# Altium schematic sheet LED.SchDoc
size A
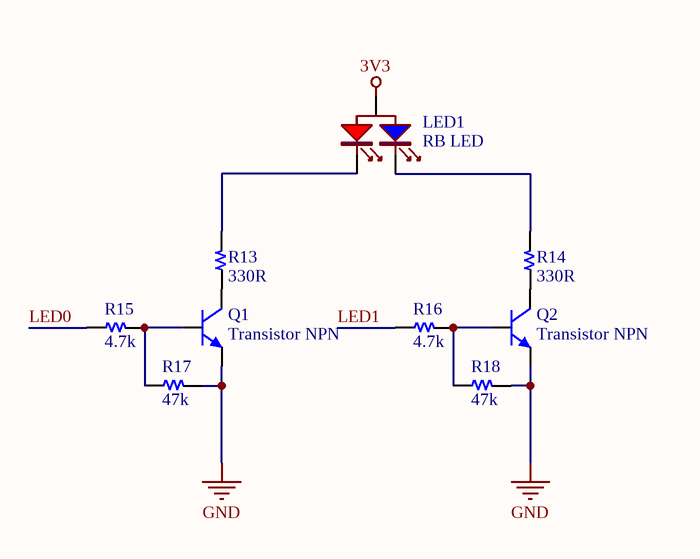
[diagram p0: LED.SchDoc]

## Parts
LED1  RB LED  [LED-BICOLOR-3MM]
Q1  Transistor NPN  [SOT-23]
Q2  Transistor NPN  [SOT-23]
R13  330R  [R 0603]
R14  330R  [R 0603]
R15  4.7k  [R 0603]
R16  4.7k  [R 0603]
R17  47k  [R 0603]
R18  47k  [R 0603]

## Nets
3V3: LED1.2(A)
GND: Q1.2(E) Q2.2(E) R17.2 R18.2
LED0: R15.1
LED1: R16.1
NetLED1_1: LED1.1(K1) R13.2
NetLED1_3: LED1.3(K2) R14.2
NetQ1_1: Q1.1(B) R15.2 R17.1
NetQ1_3: Q1.3(C) R13.1
NetQ2_1: Q2.1(B) R16.2 R18.1
NetQ2_3: Q2.3(C) R14.1

## Library data of the parts
LED1 = LED 2-color-A: Bicolor RB 3mm LED
Q1 Q2 = Transistor NPN: NPN Bipolar Transistor
R13-R18 = Resistor